# Altium project Holtek_Discovery_BS6xfxxx.PrjPcb
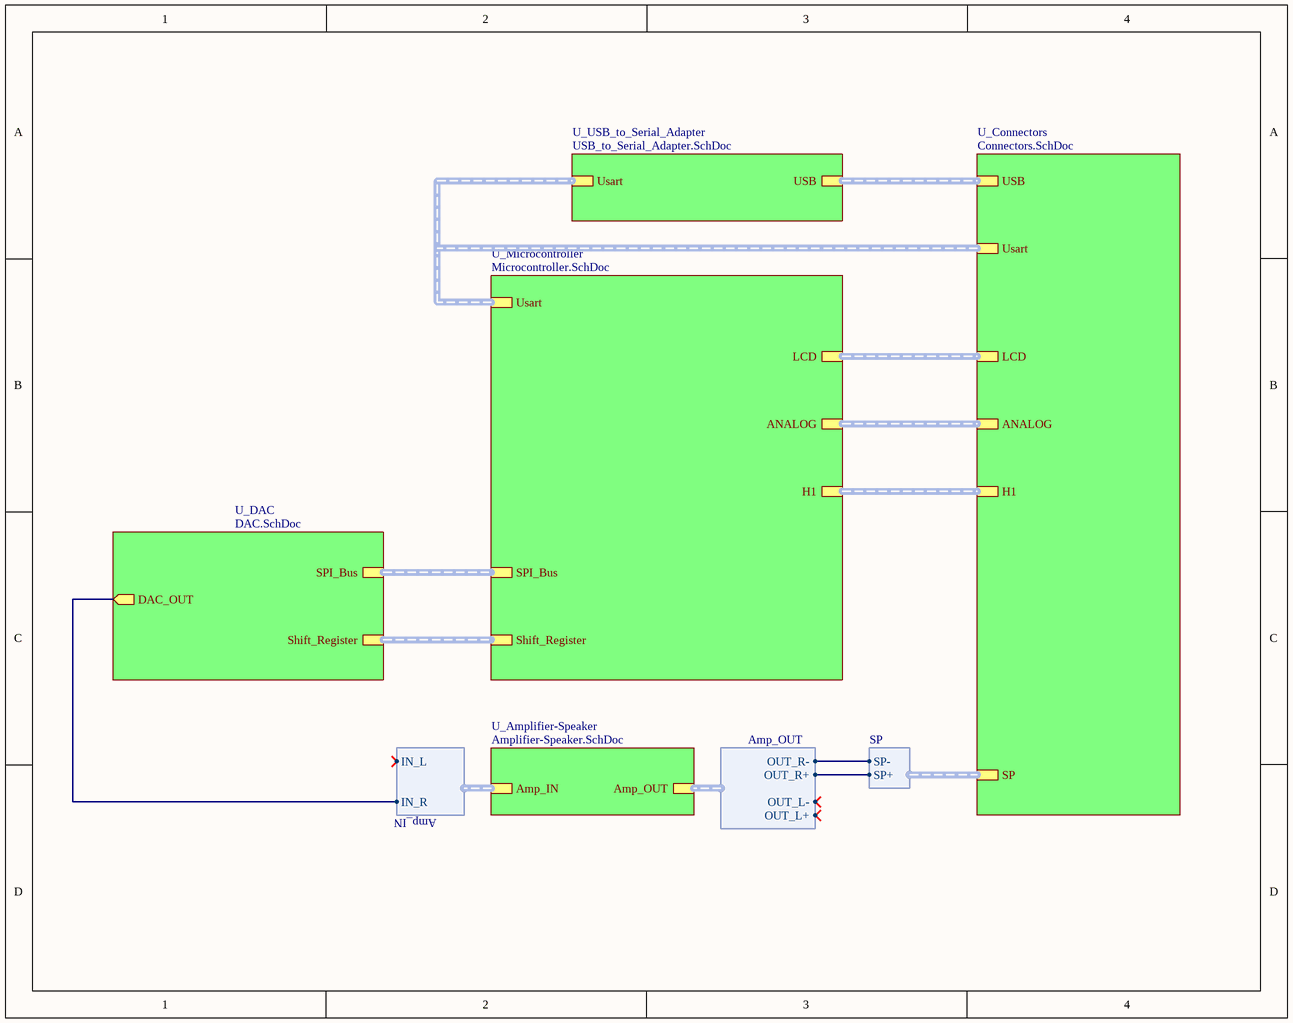
[diagram p0: Multi-sheet.SchDoc]
9 sheets, 72 parts. Net scope: hierarchical (ports join the sheet entries above them; power ports are global).
Board file: Holtek_Discovery_BS6xfxxx_TEST1.PcbDoc
Sheets:
  Multi-sheet.SchDoc
    U_USB_to_Serial_Adapter = USB_to_Serial_Adapter.SchDoc
    U_DAC = DAC.SchDoc
    U_Amplifier-Speaker = Amplifier-Speaker.SchDoc
    U_Microcontroller = Microcontroller.SchDoc
      U_Led-7Segment-Switch = Led-7Segment-Switch.SchDoc
      U_Spi_Flash = Spi_Flash.SchDoc
      U_Capacitive_touch = Capacitive_touch.SchDoc
    U_Connectors = Connectors.SchDoc

## Sheet Multi-sheet.SchDoc
size A; SheetNumber: 1; SheetTotal: 9

### Sub-sheets
U_Amplifier-Speaker = Amplifier-Speaker.SchDoc: Amp_IN (harness Amp_IN), Amp_OUT (harness Amp_OUT)
U_Connectors = Connectors.SchDoc: USB (harness USB), LCD (harness LCD), SP (harness SP), ANALOG (harness ANALOG), H1 (harness H1), Usart (harness Usart)
U_DAC = DAC.SchDoc: SPI_Bus (harness SPI_Bus), DAC_OUT (out), Shift_Register (harness SHIFT_REGISTER)
U_Microcontroller = Microcontroller.SchDoc: SPI_Bus (harness SPI_Bus), Usart (harness Usart), Shift_Register (harness Shift_Register), LCD (harness LCD), H1 (harness h1), ANALOG (harness ANALOG)
U_USB_to_Serial_Adapter = USB_to_Serial_Adapter.SchDoc: USB (harness USB), Usart (harness Usart)

### Harnesses
Amp_IN: IN_L, IN_R
Amp_OUT: OUT_L+, OUT_L-, OUT_R+, OUT_R-
SP: SP+, SP-

### Nets
DAC_OUT: sheet U_DAC/DAC_OUT, sheet U_Amplifier-Speaker/Amp_IN.IN_R
OUT_R+: sheet U_Amplifier-Speaker/Amp_OUT.OUT_R+, sheet U_Connectors/SP.SP+
OUT_R-: sheet U_Amplifier-Speaker/Amp_OUT.OUT_R-, sheet U_Connectors/SP.SP-

### Buses and harness runs
harness sheet U_Connectors/ANALOG = sheet U_Microcontroller/ANALOG
harness sheet U_Connectors/H1 = sheet U_Microcontroller/H1
harness sheet U_Connectors/LCD = sheet U_Microcontroller/LCD
harness sheet U_Connectors/Usart = sheet U_Microcontroller/Usart = sheet U_USB_to_Serial_Adapter/Usart
harness sheet U_Connectors/USB = sheet U_USB_to_Serial_Adapter/USB
harness sheet U_DAC/Shift_Register = sheet U_Microcontroller/Shift_Register
harness sheet U_DAC/SPI_Bus = sheet U_Microcontroller/SPI_Bus

## Sheet USB_to_Serial_Adapter.SchDoc
size 203 x 139 mm; SheetNumber: 8; SheetTotal: 8
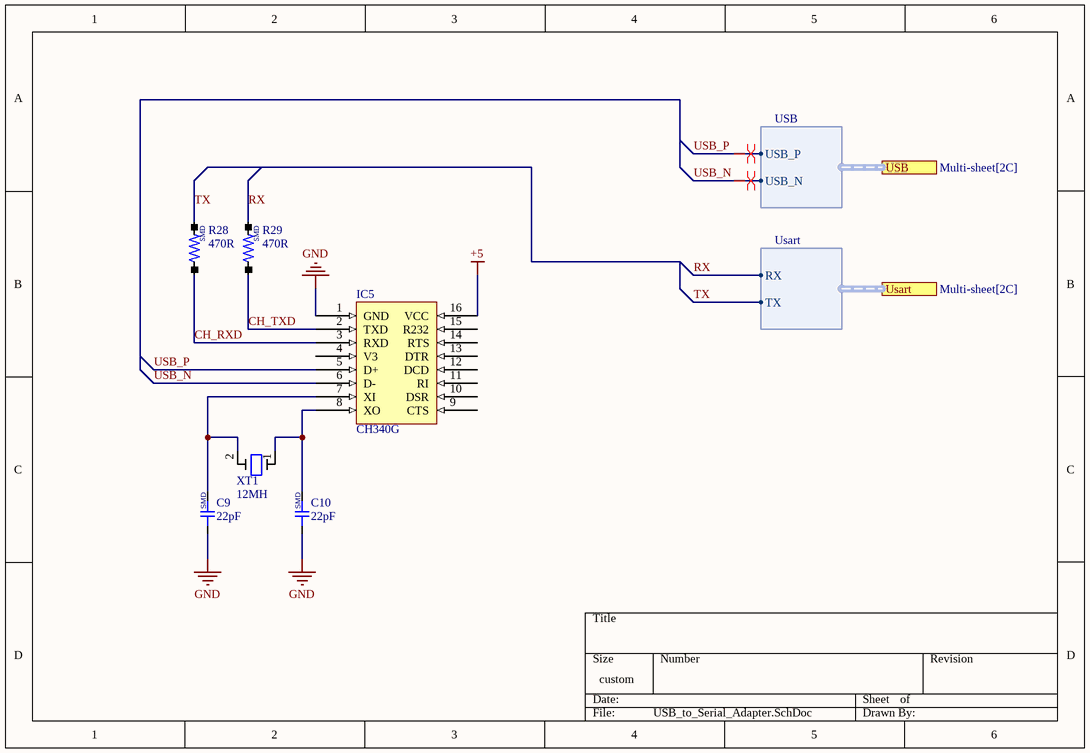
[diagram p1: USB_to_Serial_Adapter.SchDoc]

### Parts
C9  22pF  [CAP-0603]
C10  22pF  [CAP-0603]
IC5  CH340G  [SOP16]
R28  470R  [RES/0603]
R29  470R  [RES/0603]
XT1  12MH  [XTL16MH]

### Ports
Usart (harness Usart, see Multi-sheet[2C]), USB (harness USB, see Multi-sheet[2C])

### Harnesses
USB: USB_P, USB_N
Usart: RX, TX

### Nets
+5: IC5.16(VCC)
GND: C9.1 C10.1 IC5.1(GND)
CH_RXD: IC5.3(RXD) R28.1
CH_TXD: IC5.2(TXD) R29.1
RX: R29.2 ; port Usart.RX
TX: R28.2 ; port Usart.TX
USB_N: IC5.6(D-) ; port USB.USB_N
USB_P: IC5.5(D+) ; port USB.USB_P
NetC9_2: C9.2 IC5.7(XI) XT1.2
NetC10_2: C10.2 IC5.8(XO) XT1.1

Not connected (* = marked no-connect by the designer): IC5 4(V3) 9(CTS) 10(DSR) 11(RI) 12(DCD) 13(DTR) 14(RTS) 15(R232)

### Layout directives
differential pair: USB_N, USB_P

### Notes on the sheet
- (in symbol cap_smd) SMD
- (in symbol RES/SMD) SMD

### Library data of the parts
C9 C10 = cap_smd
R28 R29 = RES/SMD
XT1 = XTL16

## Sheet DAC.SchDoc
size 254 x 241 mm; SheetNumber: 8; SheetTotal: 9
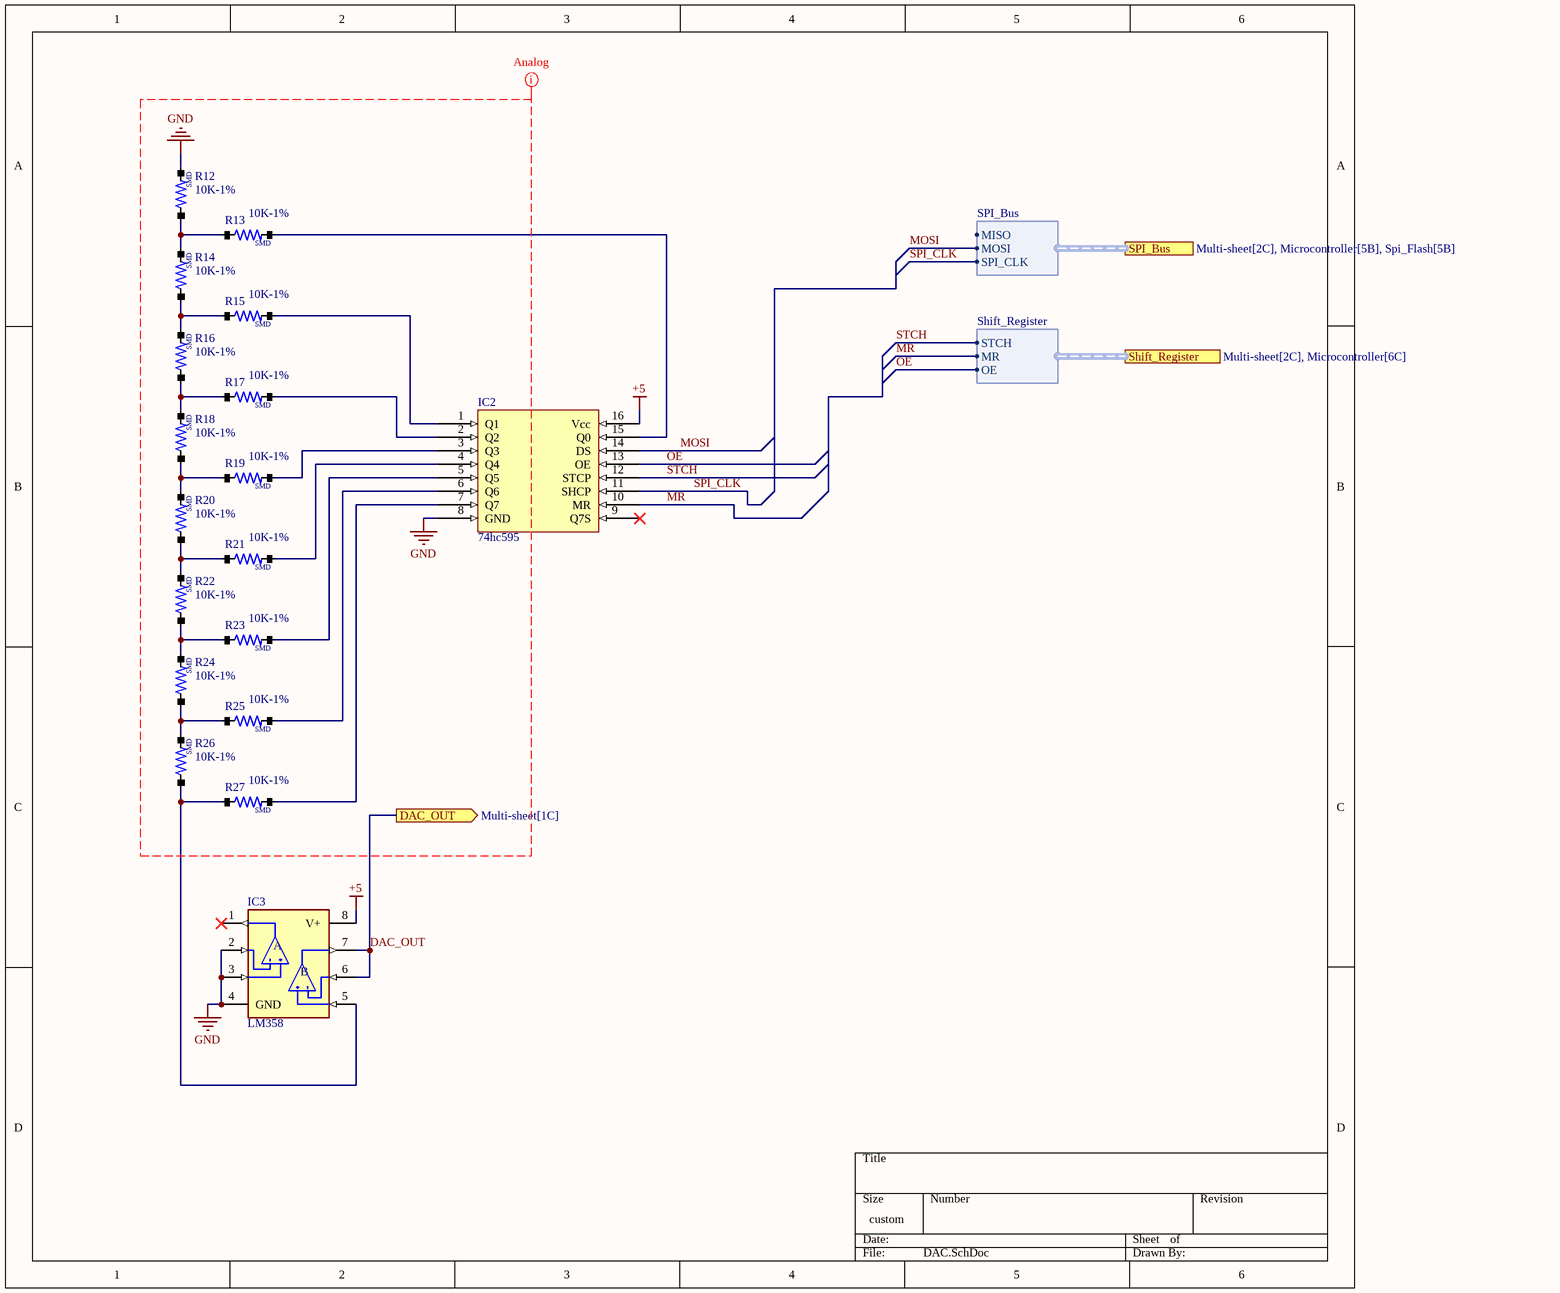
[diagram p2: DAC.SchDoc]

### Parts
IC2  74hc595  [SOP16]
IC3  LM358  [SOP-8]
R12  10K-1%  [RES/0603]
R13  10K-1%  [RES/0603]
R14  10K-1%  [RES/0603]
R15  10K-1%  [RES/0603]
R16  10K-1%  [RES/0603]
R17  10K-1%  [RES/0603]
R18  10K-1%  [RES/0603]
R19  10K-1%  [RES/0603]
R20  10K-1%  [RES/0603]
R21  10K-1%  [RES/0603]
R22  10K-1%  [RES/0603]
R23  10K-1%  [RES/0603]
R24  10K-1%  [RES/0603]
R25  10K-1%  [RES/0603]
R26  10K-1%  [RES/0603]
R27  10K-1%  [RES/0603]

### Ports
DAC_OUT (out, see Multi-sheet[1C]), Shift_Register (harness Shift_Register, see Multi-sheet[2C], Microcontroller[6C]), SPI_Bus (harness SPI_Bus, see Multi-sheet[2C], Microcontroller[5B], Spi_Flash[5B])

### Harnesses
SPI_Bus: MISO, MOSI, SPI_CLK
Shift_Register: STCH, MR, OE

### Nets
+5: IC2.16(Vcc) IC3.8(V+)
GND: IC2.8(GND) IC3.2(-INA) IC3.3(+INA) IC3.4(GND) R12.2
DAC_OUT: IC3.6(-INB) IC3.7(OUTB) ; port DAC_OUT
MOSI: IC2.14(DS) ; port SPI_Bus.MOSI
MR: IC2.10(MR) ; port Shift_Register.MR
OE: IC2.13(OE) ; port Shift_Register.OE
SPI_CLK: IC2.11(SHCP) ; port SPI_Bus.SPI_CLK
STCH: IC2.12(STCP) ; port Shift_Register.STCH
NetIC2_1: IC2.1(Q1) R15.2
NetIC2_2: IC2.2(Q2) R17.2
NetIC2_3: IC2.3(Q3) R19.2
NetIC2_4: IC2.4(Q4) R21.2
NetIC2_5: IC2.5(Q5) R23.2
NetIC2_6: IC2.6(Q6) R25.2
NetIC2_7: IC2.7(Q7) R27.2
NetIC2_15: IC2.15(Q0) R13.2
NetIC3_5: IC3.5(+INB) R26.1 R27.1
NetR12_1: R12.1 R13.1 R14.2
NetR14_1: R14.1 R15.1 R16.2
NetR16_1: R16.1 R17.1 R18.2
NetR18_1: R18.1 R19.1 R20.2
NetR20_1: R20.1 R21.1 R22.2
NetR22_1: R22.1 R23.1 R24.2
NetR24_1: R24.1 R25.1 R26.2

Not connected (* = marked no-connect by the designer): IC2 9(Q7S)*; IC3 1(OUTA)*

### Layout directives
net class Analog: GND

### Notes on the sheet
- (in symbol LM358) A; B
- (in symbol RES/SMD) SMD

### Library data of the parts
R12-R27 = RES/SMD

## Sheet Amplifier-Speaker.SchDoc
size A; SheetNumber: 7; SheetTotal: 9
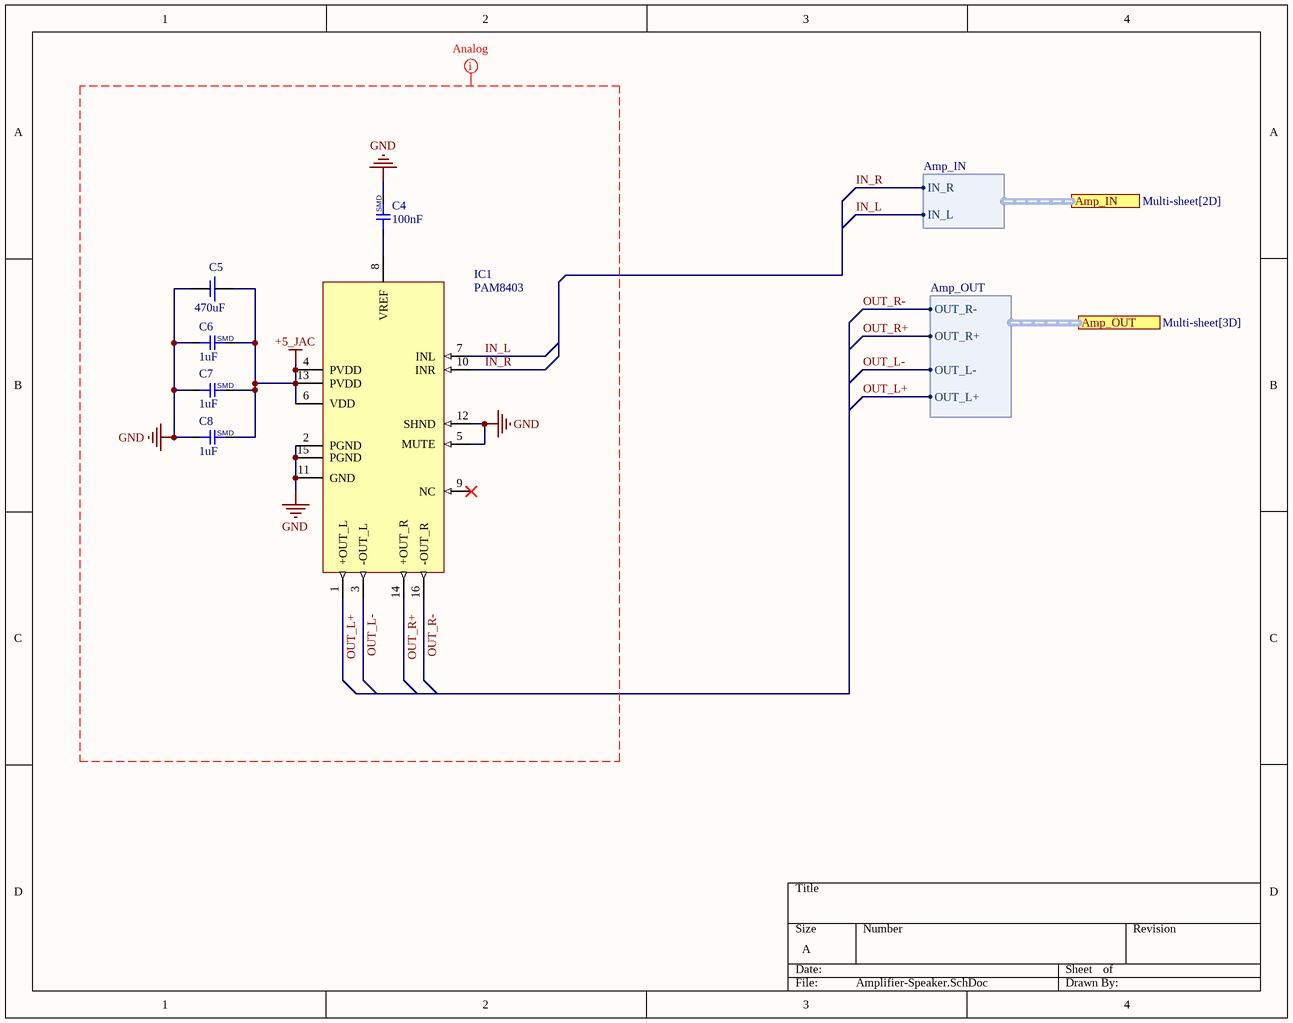
[diagram p3: Amplifier-Speaker.SchDoc]

### Parts
C4  100nF  [CAP-0603]
C5  470uF  [cap/330u/16v]
C6  1uF  [CAP-0805]
C7  1uF  [CAP-0805]
C8  1uF  [CAP-0805]
IC1  PAM8403  [SOP16]

### Ports
Amp_IN (harness Amp_IN, see Multi-sheet[2D]), Amp_OUT (harness Amp_OUT, see Multi-sheet[3D])

### Harnesses
Amp_IN: IN_R, IN_L
Amp_OUT: OUT_R-, OUT_R+, OUT_L-, OUT_L+

### Nets
+5_JAC: C5.+ C6.2 C7.2 C8.2 IC1.4(PVDD) IC1.6(VDD) IC1.13(PVDD)
GND: C4.2 C5.- C6.1 C7.1 C8.1 IC1.2(PGND) IC1.5(MUTE) IC1.11(GND) IC1.12(SHND) IC1.15(PGND)
IN_L: IC1.7(INL) ; port Amp_IN.IN_L
IN_R: IC1.10(INR) ; port Amp_IN.IN_R  [project net DAC_OUT]
OUT_L+: IC1.1(+OUT_L) ; port Amp_OUT.OUT_L+
OUT_L-: IC1.3(-OUT_L) ; port Amp_OUT.OUT_L-
OUT_R+: IC1.14(+OUT_R) ; port Amp_OUT.OUT_R+
OUT_R-: IC1.16(-OUT_R) ; port Amp_OUT.OUT_R-
NetC4_1: C4.1 IC1.8(VREF)

Not connected (* = marked no-connect by the designer): IC1 9(NC)*

### Layout directives
net class Analog: +5_JAC, GND, IN_L, IN_R, OUT_L+, OUT_L-, OUT_R+, OUT_R-

### Notes on the sheet
- (in symbol cap_smd) SMD

### Library data of the parts
C4 C6-C8 = cap_smd
C5 = cap-electrolit
IC1 = PAM8403: STEREO AUDIO AMPLIFIER

## Sheet Microcontroller.SchDoc
size 381 x 241 mm; SheetNumber: 3; SheetTotal: 9
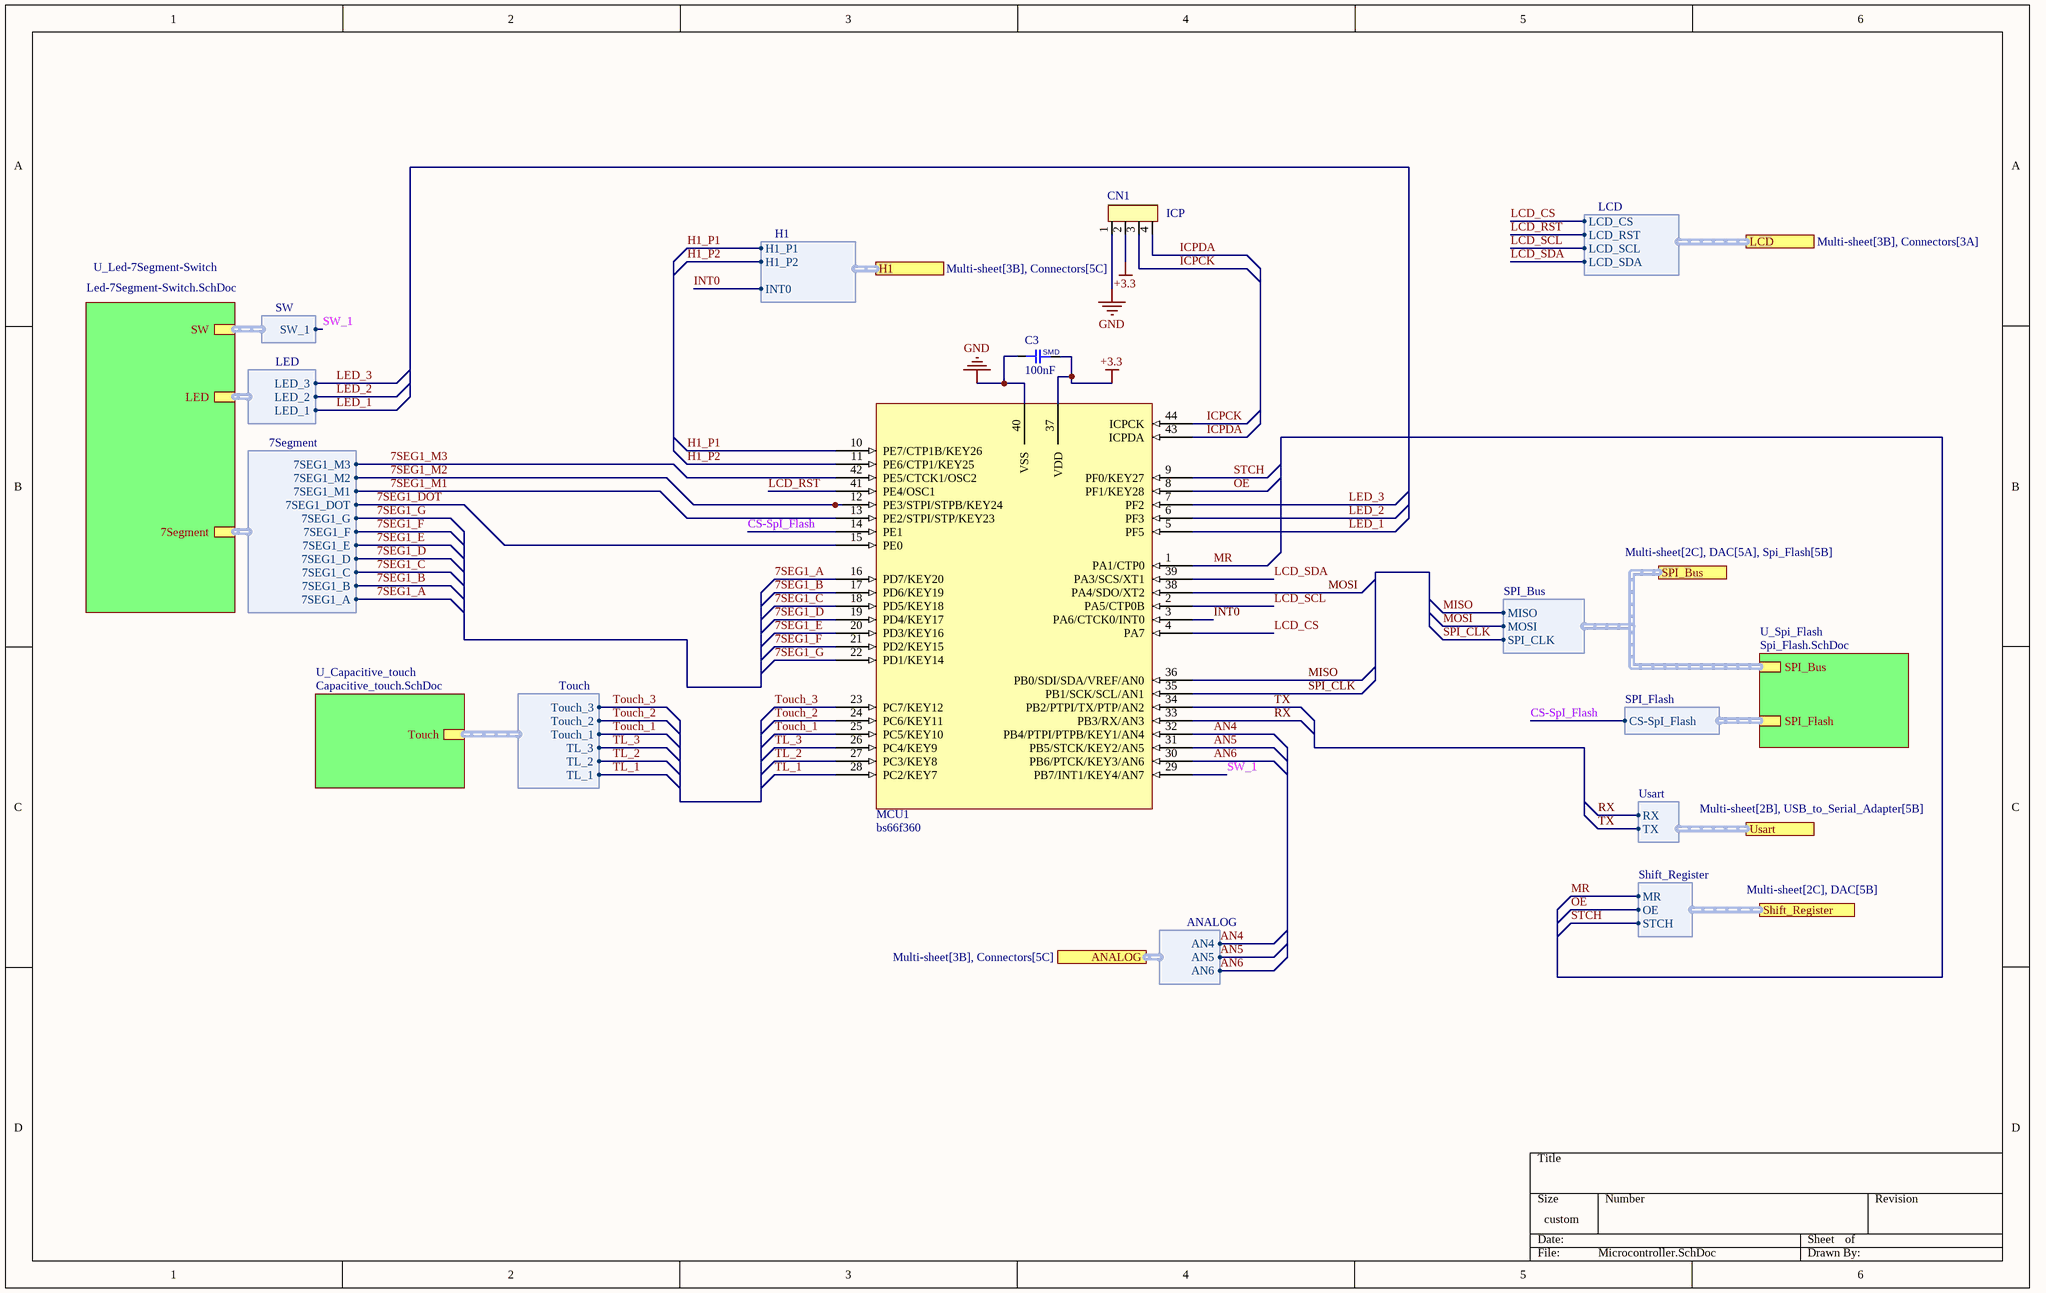
[diagram p4: Microcontroller.SchDoc]

### Parts
C3  100nF  [CAP-0603]
CN1  ICP  [CONECTOR/XH/4PIN]
MCU1  bs66f360  [bs66f360]

### Sub-sheets
U_Capacitive_touch = Capacitive_touch.SchDoc: Touch (harness Touch)
U_Led-7Segment-Switch = Led-7Segment-Switch.SchDoc: LED (harness LED), 7Segment (harness 7Segment), SW (harness SW)
U_Spi_Flash = Spi_Flash.SchDoc: SPI_Flash (harness SPI_Flash), SPI_Bus (harness SPI_Bus)

### Ports
ANALOG (harness ANALOG, see Multi-sheet[3B], Connectors[5C]), H1 (harness H1, see Multi-sheet[3B], Connectors[5C]), LCD (harness LCD, see Multi-sheet[3B], Connectors[3A]), Shift_Register (harness Shift_Register, see Multi-sheet[2C], DAC[5B]), SPI_Bus (harness SPI_Bus, see Multi-sheet[2C], DAC[5A], Spi_Flash[5B]), Usart (harness Usart, see Multi-sheet[2B], USB_to_Serial_Adapter[5B])

### Harnesses
7Segment: 7SEG1_A, 7SEG1_B, 7SEG1_C, 7SEG1_D, 7SEG1_DOT, 7SEG1_E, 7SEG1_F, 7SEG1_G, 7SEG1_M1, 7SEG1_M2, 7SEG1_M3
LED: LED_1, LED_2, LED_3
SW: SW_1
SPI_Bus: MISO, MOSI, SPI_CLK
SPI_Flash: CS-SpI_Flash
Usart: RX, TX
Shift_Register: MR, OE, STCH
Touch: TL_1, TL_2, TL_3, Touch_1, Touch_2, Touch_3
LCD: LCD_CS, LCD_RST, LCD_SCL, LCD_SDA
H1: H1_P1, H1_P2, INT0
ANALOG: AN4, AN5, AN6

### Nets
+3.3: C3.2 CN1.2 MCU1.37(VDD)
GND: C3.1 CN1.1 MCU1.40(VSS)
7SEG1_A: MCU1.16(PD7/KEY20) ; sheet U_Led-7Segment-Switch/7Segment.7SEG1_A
7SEG1_B: MCU1.17(PD6/KEY19) ; sheet U_Led-7Segment-Switch/7Segment.7SEG1_B
7SEG1_C: MCU1.18(PD5/KEY18) ; sheet U_Led-7Segment-Switch/7Segment.7SEG1_C
7SEG1_D: MCU1.19(PD4/KEY17) ; sheet U_Led-7Segment-Switch/7Segment.7SEG1_D
7SEG1_DOT: MCU1.15(PE0) ; sheet U_Led-7Segment-Switch/7Segment.7SEG1_DOT
7SEG1_E: MCU1.20(PD3/KEY16) ; sheet U_Led-7Segment-Switch/7Segment.7SEG1_E
7SEG1_F: MCU1.21(PD2/KEY15) ; sheet U_Led-7Segment-Switch/7Segment.7SEG1_F
7SEG1_G: MCU1.22(PD1/KEY14) ; sheet U_Led-7Segment-Switch/7Segment.7SEG1_G
7SEG1_M1: MCU1.13(PE2/STPI/STP/KEY23) ; sheet U_Led-7Segment-Switch/7Segment.7SEG1_M1
7SEG1_M2: MCU1.12(PE3/STPI/STPB/KEY24) ; sheet U_Led-7Segment-Switch/7Segment.7SEG1_M2
7SEG1_M3: MCU1.42(PE5/CTCK1/OSC2) ; sheet U_Led-7Segment-Switch/7Segment.7SEG1_M3
AN4: MCU1.32(PB4/PTPI/PTPB/KEY1/AN4) ; port ANALOG.AN4
AN5: MCU1.31(PB5/STCK/KEY2/AN5) ; port ANALOG.AN5
AN6: MCU1.30(PB6/PTCK/KEY3/AN6) ; port ANALOG.AN6
CS-SpI_Flash: MCU1.14(PE1) ; sheet U_Spi_Flash/SPI_Flash.CS-SpI_Flash
H1_P1: MCU1.10(PE7/CTP1B/KEY26) ; port H1.H1_P1
H1_P2: MCU1.11(PE6/CTP1/KEY25) ; port H1.H1_P2
ICPCK: CN1.3 MCU1.44(ICPCK)
ICPDA: CN1.4 MCU1.43(ICPDA)
INT0: MCU1.3(PA6/CTCK0/INT0) ; port H1.INT0
LCD_CS: MCU1.4(PA7) ; port LCD.LCD_CS
LCD_RST: MCU1.41(PE4/OSC1) ; port LCD.LCD_RST
LCD_SCL: MCU1.2(PA5/CTP0B) ; port LCD.LCD_SCL
LCD_SDA: MCU1.39(PA3/SCS/XT1) ; port LCD.LCD_SDA
LED_1: MCU1.5(PF5) ; sheet U_Led-7Segment-Switch/LED.LED_1
LED_2: MCU1.6(PF3) ; sheet U_Led-7Segment-Switch/LED.LED_2
LED_3: MCU1.7(PF2) ; sheet U_Led-7Segment-Switch/LED.LED_3
MISO: MCU1.36(PB0/SDI/SDA/VREF/AN0) ; port SPI_Bus.MISO
MOSI: MCU1.38(PA4/SDO/XT2) ; port SPI_Bus.MOSI
MR: MCU1.1(PA1/CTP0) ; port Shift_Register.MR
OE: MCU1.8(PF1/KEY28) ; port Shift_Register.OE
RX: MCU1.33(PB3/RX/AN3) ; port Usart.RX
SPI_CLK: MCU1.35(PB1/SCK/SCL/AN1) ; port SPI_Bus.SPI_CLK
STCH: MCU1.9(PF0/KEY27) ; port Shift_Register.STCH
SW_1: MCU1.29(PB7/INT1/KEY4/AN7) ; sheet U_Led-7Segment-Switch/SW.SW_1
TL_1: MCU1.28(PC2/KEY7) ; sheet U_Capacitive_touch/Touch.TL_1
TL_2: MCU1.27(PC3/KEY8) ; sheet U_Capacitive_touch/Touch.TL_2
TL_3: MCU1.26(PC4/KEY9) ; sheet U_Capacitive_touch/Touch.TL_3
Touch_1: MCU1.25(PC5/KEY10) ; sheet U_Capacitive_touch/Touch.Touch_1
Touch_2: MCU1.24(PC6/KEY11) ; sheet U_Capacitive_touch/Touch.Touch_2
Touch_3: MCU1.23(PC7/KEY12) ; sheet U_Capacitive_touch/Touch.Touch_3
TX: MCU1.34(PB2/PTPI/TX/PTP/AN2) ; port Usart.TX

### Buses and harness runs
harness port SPI_Bus = sheet U_Spi_Flash/SPI_Bus

### Notes on the sheet
- (in symbol cap_smd) SMD

### Library data of the parts
C3 = cap_smd
CN1 = CONECTOR/XH/4PIN

## Sheet Led-7Segment-Switch.SchDoc
size 254 x 241 mm; SheetNumber: 3; SheetTotal: 8
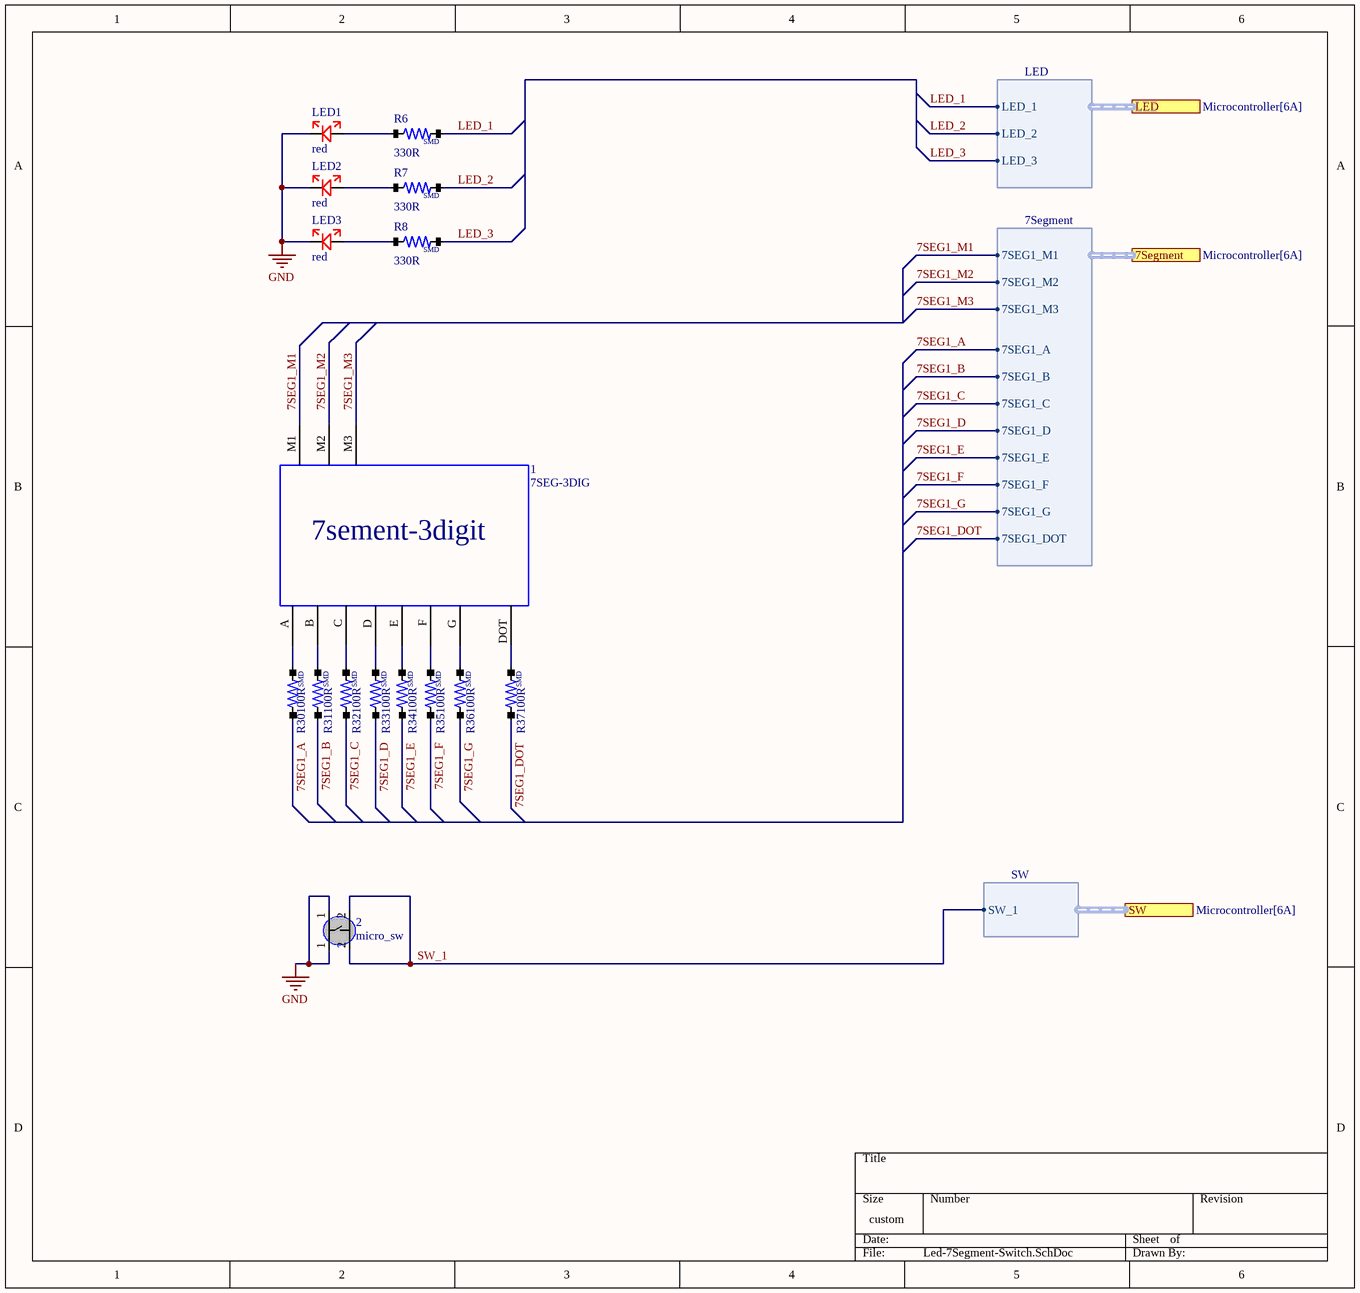
[diagram p5: Led-7Segment-Switch.SchDoc]

### Parts
1  7SEG-3DIG  [7seg-3d]
2  micro_sw  [micro_switch_smd]
LED1  red  [LED/0805]
LED2  red  [LED/0805]
LED3  red  [LED/0805]
R6  330R  [RES/0603]
R7  330R  [RES/0603]
R8  330R  [RES/0603]
R30  100R  [RES/0603]
R31  100R  [RES/0603]
R32  100R  [RES/0603]
R33  100R  [RES/0603]
R34  100R  [RES/0603]
R35  100R  [RES/0603]
R36  100R  [RES/0603]
R37  100R  [RES/0603]

### Ports
7Segment (harness 7Segment, see Microcontroller[6A]), LED (harness LED, see Microcontroller[6A]), SW (harness SW, see Microcontroller[6A])

### Harnesses
LED: LED_1, LED_2, LED_3
7Segment: 7SEG1_M1, 7SEG1_M2, 7SEG1_M3, 7SEG1_A, 7SEG1_B, 7SEG1_C, 7SEG1_D, 7SEG1_E, 7SEG1_F, 7SEG1_G, 7SEG1_DOT
SW: SW_1

### Nets
GND: 2.1 LED1.A LED2.A LED3.A
7SEG1_A: R30.1 ; port 7Segment.7SEG1_A
7SEG1_B: R31.1 ; port 7Segment.7SEG1_B
7SEG1_C: R32.1 ; port 7Segment.7SEG1_C
7SEG1_D: R33.1 ; port 7Segment.7SEG1_D
7SEG1_DOT: R37.1 ; port 7Segment.7SEG1_DOT
7SEG1_E: R34.1 ; port 7Segment.7SEG1_E
7SEG1_F: R35.1 ; port 7Segment.7SEG1_F
7SEG1_G: R36.1 ; port 7Segment.7SEG1_G
7SEG1_M1: 1.M1 ; port 7Segment.7SEG1_M1
7SEG1_M2: 1.M2 ; port 7Segment.7SEG1_M2
7SEG1_M3: 1.M3 ; port 7Segment.7SEG1_M3
LED_1: R6.2 ; port LED.LED_1
LED_2: R7.2 ; port LED.LED_2
LED_3: R8.2 ; port LED.LED_3
SW_1: 2.2 ; port SW.SW_1
Net1_A: 1.A R30.2
Net1_B: 1.B R31.2
Net1_C: 1.C R32.2
Net1_D: 1.D R33.2
Net1_DOT: 1.DOT R37.2
Net1_E: 1.E R34.2
Net1_F: 1.F R35.2
Net1_G: 1.G R36.2
NetLED1_K: LED1.K R6.1
NetLED2_K: LED2.K R7.1
NetLED3_K: LED3.K R8.1

### Notes on the sheet
- (in symbol 7SEG-3DIG) 7sement-3digit
- (in symbol RES/SMD) SMD

### Library data of the parts
LED1-LED3 = LED-1COLER
R6-R8 R30-R37 = RES/SMD

## Sheet Spi_Flash.SchDoc
size 127 x 127 mm; SheetNumber: 6; SheetTotal: 8
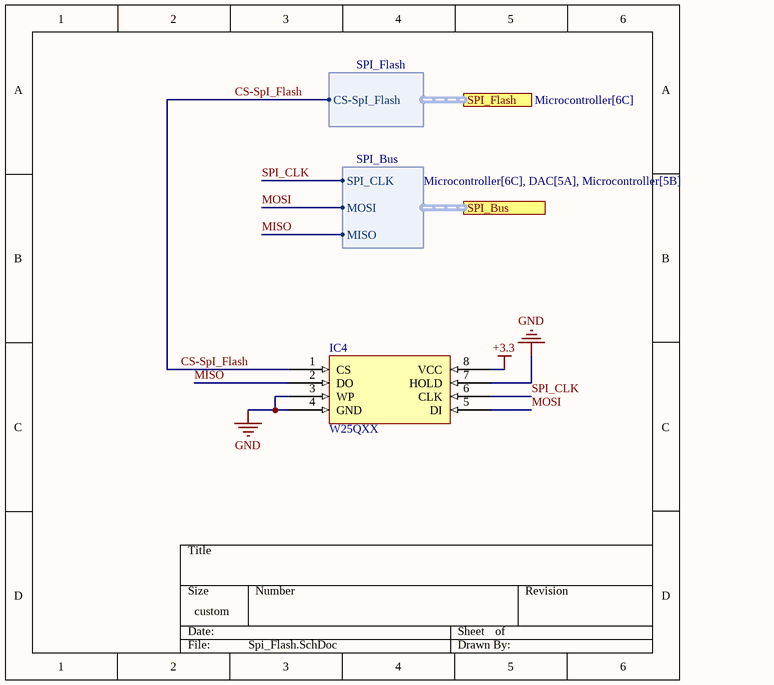
[diagram p6: Spi_Flash.SchDoc]

### Parts
IC4  W25QXX  [SOIC-8PIN-280MIL]

### Ports
SPI_Bus (harness SPI_Bus, see Microcontroller[6C], DAC[5A], Microcontroller[5B]), SPI_Flash (harness SPI_Flash, see Microcontroller[6C])

### Harnesses
SPI_Flash: CS-SpI_Flash
SPI_Bus: SPI_CLK, MOSI, MISO

### Nets
+3.3: IC4.8(VCC)
GND: IC4.3(WP) IC4.4(GND) IC4.7(HOLD)
CS-SpI_Flash: IC4.1(CS) ; port SPI_Flash.CS-SpI_Flash
MISO: IC4.2(DO) ; port SPI_Bus.MISO
MOSI: IC4.5(DI) ; port SPI_Bus.MOSI
SPI_CLK: IC4.6(CLK) ; port SPI_Bus.SPI_CLK

## Sheet Capacitive_touch.SchDoc
size 228 x 139 mm; SheetNumber: 4; SheetTotal: 8
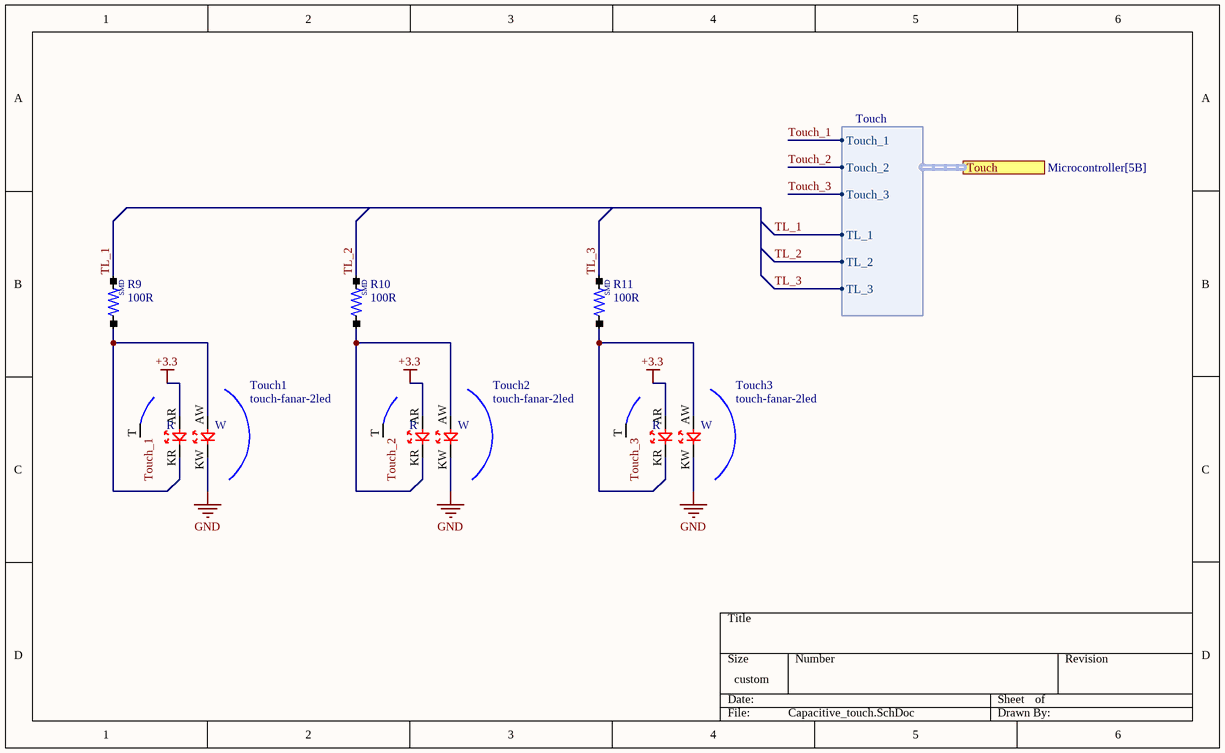
[diagram p7: Capacitive_touch.SchDoc]

### Parts
R9  100R  [RES/0603]
R10  100R  [RES/0603]
R11  100R  [RES/0603]
Touch1  touch-fanar-2led  [fanar-touch-2led]
Touch2  touch-fanar-2led  [fanar-touch-2led]
Touch3  touch-fanar-2led  [fanar-touch-2led]

### Ports
Touch (harness Touch, see Microcontroller[5B])

### Harnesses
Touch: Touch_1, Touch_2, Touch_3, TL_1, TL_2, TL_3

### Nets
+3.3: Touch1.AR Touch2.AR Touch3.AR
GND: Touch1.KW Touch2.KW Touch3.KW
TL_1: R9.2 ; port Touch.TL_1
TL_2: R10.2 ; port Touch.TL_2
TL_3: R11.2 ; port Touch.TL_3
Touch_1: Touch1.T ; port Touch.Touch_1
Touch_2: Touch2.T ; port Touch.Touch_2
Touch_3: Touch3.T ; port Touch.Touch_3
NetR9_1: R9.1 Touch1.AW Touch1.KR
NetR10_1: R10.1 Touch2.AW Touch2.KR
NetR11_1: R11.1 Touch3.AW Touch3.KR

### Notes on the sheet
- (in symbol RES/SMD) SMD
- (in symbol touch-fanar-2led) R; W

### Library data of the parts
R9-R11 = RES/SMD

## Sheet Connectors.SchDoc
size 279 x 241 mm; SheetNumber: 2; SheetTotal: 9
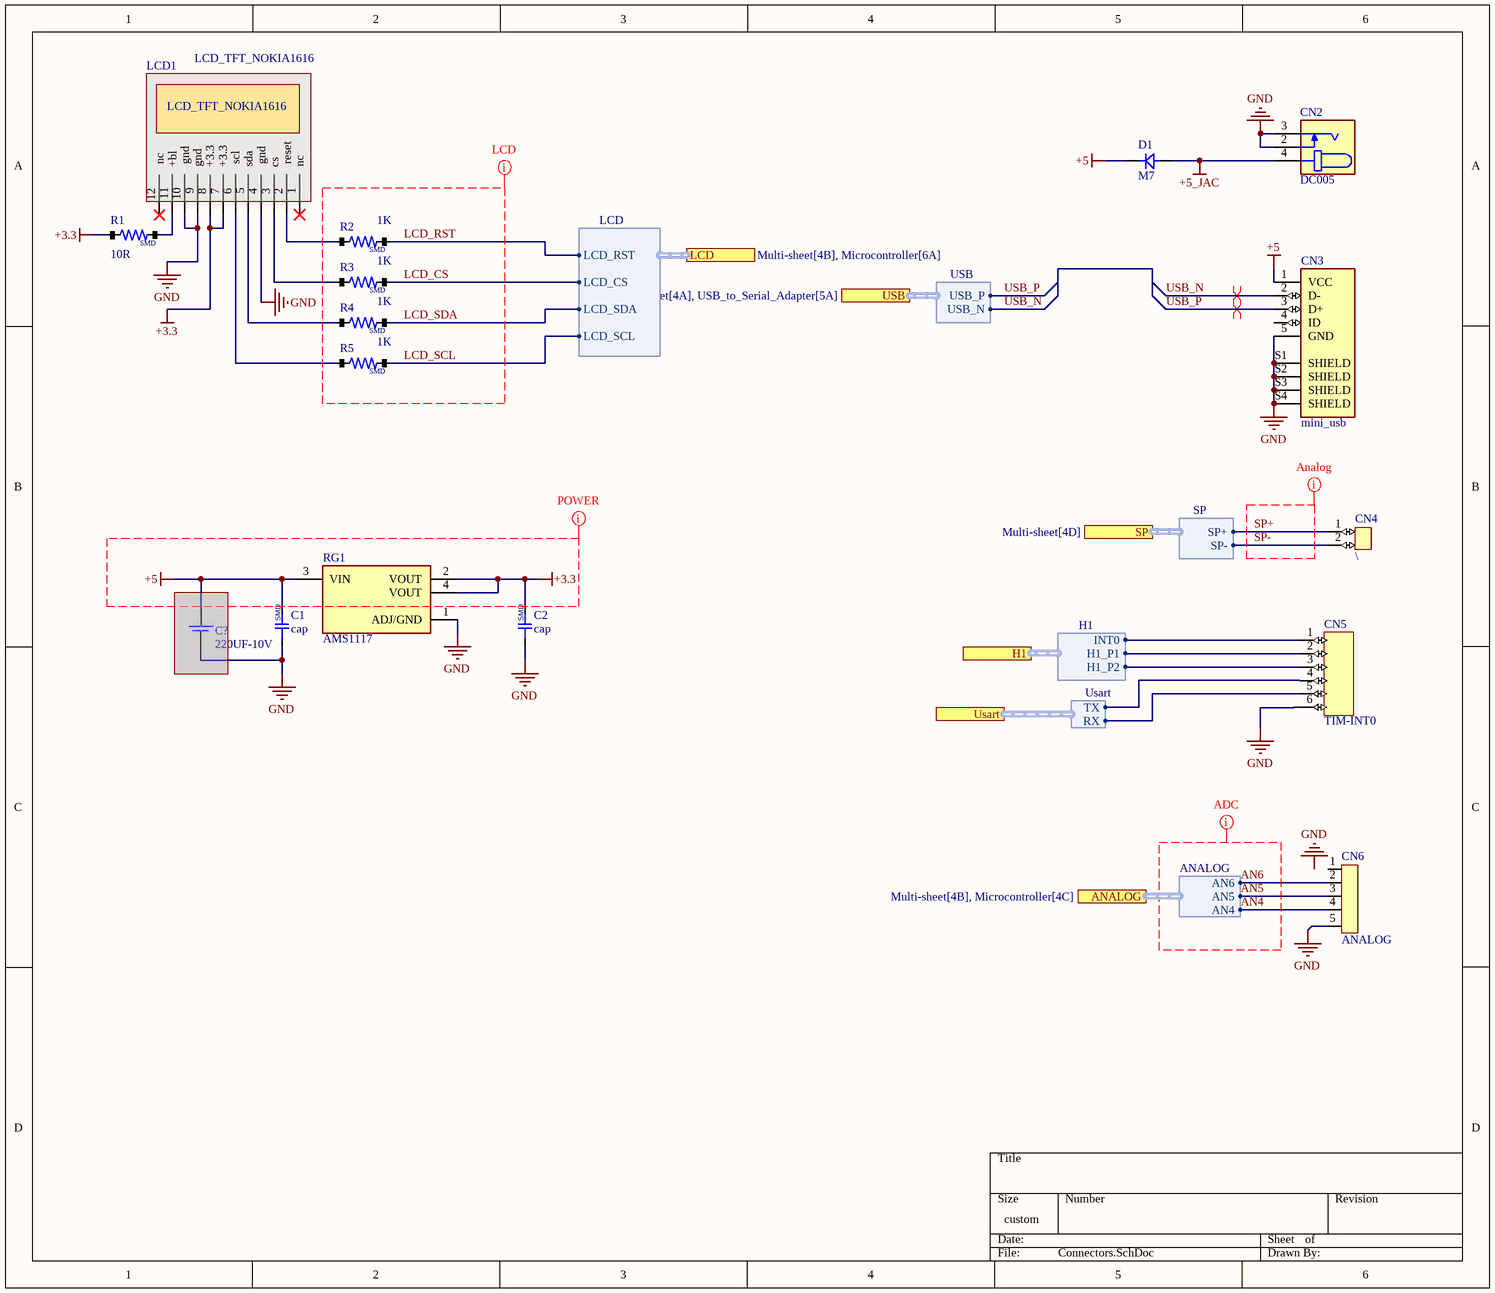
[diagram p8: Connectors.SchDoc]

### Parts
C1  cap  [CAP-0603]
C2  cap  [CAP-0603]
C?  220UF-10V  [cap/330u/16v]  (masked out: inside a compile mask, not in the netlist)
CN2  DC005  [dc005]
CN3  mini_usb  [usb_mini_smd]
CN4  \  [CONECTOR/XH/2PIN]
CN5  TIM-INT0  [pin_header_6pin]
CN6  ANALOG  [XH5]
D1  M7  [DIOD/1N4007/SMD]
LCD1  LCD_TFT_NOKIA1616  [lcd1616-flat]
R1  10R  [RES/0805]
R2  1K  [RES/0805]
R3  1K  [RES/0805]
R4  1K  [RES/0805]
R5  1K  [RES/0805]
RG1  AMS1117  [AMS1117]

### Ports
ANALOG (harness ANALOG, see Multi-sheet[4B], Microcontroller[4C]), H1 (harness H1), LCD (harness LCD, see Multi-sheet[4B], Microcontroller[6A]), SP (harness SP, see Multi-sheet[4D]), Usart (harness Usart), USB (harness USB, see Multi-sheet[4A], USB_to_Serial_Adapter[5A])

### Harnesses
USB: USB_N, USB_P
LCD: LCD_RST, LCD_CS, LCD_SDA, LCD_SCL
SP: SP-, SP+
ANALOG: AN4, AN5, AN6
H1: H1_P1, H1_P2, INT0
Usart: RX, TX

### Nets
+3.3: C2.2 LCD1.7(+3.3) LCD1.8(+3.3) R1.1 RG1.2(VOUT) RG1.4(VOUT)
+5: C1.2 CN3.1(VCC) D1.K RG1.3(VIN)
+5_JAC: CN2.4 D1.A
GND: C1.1 C2.1 CN2.2 CN2.3 CN3.5(GND) CN3.S1(SHIELD) CN3.S2(SHIELD) CN3.S3(SHIELD) CN3.S4(SHIELD) CN5.6 CN6.5 LCD1.4(gnd) LCD1.9(gnd) LCD1.10(gnd) RG1.1(ADJ/GND)
AN4: CN6.4 ; port ANALOG.AN4
AN5: CN6.3 ; port ANALOG.AN5
AN6: CN6.2 ; port ANALOG.AN6
H1_P1: CN5.2 ; port H1.H1_P1
H1_P2: CN5.3 ; port H1.H1_P2
INT0: CN5.1 ; port H1.INT0
LCD_CS: R3.2 ; port LCD.LCD_CS
LCD_RST: R2.2 ; port LCD.LCD_RST
LCD_SCL: R5.2 ; port LCD.LCD_SCL
LCD_SDA: R4.2 ; port LCD.LCD_SDA
RX: CN5.5 ; port Usart.RX
SP+: CN4.1 ; port SP.SP+  [project net OUT_R+]
SP-: CN4.2 ; port SP.SP-  [project net OUT_R-]
TX: CN5.4 ; port Usart.TX
USB_N: CN3.2(D-) ; port USB.USB_N
USB_P: CN3.3(D+) ; port USB.USB_P
NetLCD1_2: LCD1.2(reset) R2.1
NetLCD1_3: LCD1.3(cs) R3.1
NetLCD1_5: LCD1.5(sda) R4.1
NetLCD1_6: LCD1.6(scl) R5.1
NetLCD1_11: LCD1.11(+bl) R1.2

Not connected (* = marked no-connect by the designer): CN3 4(ID); CN6 1; LCD1 1(nc)* 12(_nc)*

### Layout directives
differential pair: USB_N, USB_P
net class POWER: +3.3, +5
net class LCD: LCD_CS, LCD_RST, LCD_SCL, LCD_SDA
net class Analog: SP+, SP-
net class ADC: AN4, AN5, AN6

### Notes on the sheet
- Labels drawn without touching a wire or pin: GND
- (in symbol cap_smd) SMD
- (in symbol RES/SMD) SMD

### Library data of the parts
C1 C2 = cap_smd
C? = cap-electrolit
CN2 = JAC_ADAPTOR
CN3 = usb_mini
CN4 = CONECTOR/XH/2PIN
CN5 = PIN_HEADER6
CN6 = XH5
D1 = DIOD/RECTIFIERS
LCD1 = lcd_nokia1616
R1-R5 = RES/SMD

## Nets that join several sheets
+3.3: Microcontroller (C3.2 CN1.2 MCU1.37), Spi_Flash (IC4.8), Capacitive_touch (Touch1.AR Touch2.AR Touch3.AR), Connectors (6 pins)
+5: USB_to_Serial_Adapter (IC5.16), DAC (IC2.16 IC3.8), Connectors (C1.2 CN3.1 D1.K RG1.3)
+5_JAC: Amplifier-Speaker (7 pins), Connectors (CN2.4 D1.A)
GND: USB_to_Serial_Adapter (C9.1 C10.1 IC5.1), DAC (5 pins), Amplifier-Speaker (10 pins), Microcontroller (C3.1 CN1.1 MCU1.40), Led-7Segment-Switch (2.1 LED1.A LED2.A LED3.A), Spi_Flash (IC4.3 IC4.4 IC4.7), Capacitive_touch (Touch1.KW Touch2.KW Touch3.KW), Connectors (15 pins)
7SEG1_A: Microcontroller (MCU1.16), Led-7Segment-Switch (R30.1)
7SEG1_B: Microcontroller (MCU1.17), Led-7Segment-Switch (R31.1)
7SEG1_C: Microcontroller (MCU1.18), Led-7Segment-Switch (R32.1)
7SEG1_D: Microcontroller (MCU1.19), Led-7Segment-Switch (R33.1)
7SEG1_DOT: Microcontroller (MCU1.15), Led-7Segment-Switch (R37.1)
7SEG1_E: Microcontroller (MCU1.20), Led-7Segment-Switch (R34.1)
7SEG1_F: Microcontroller (MCU1.21), Led-7Segment-Switch (R35.1)
7SEG1_G: Microcontroller (MCU1.22), Led-7Segment-Switch (R36.1)
7SEG1_M1: Microcontroller (MCU1.13), Led-7Segment-Switch (1.M1)
7SEG1_M2: Microcontroller (MCU1.12), Led-7Segment-Switch (1.M2)
7SEG1_M3: Microcontroller (MCU1.42), Led-7Segment-Switch (1.M3)
AN4: Microcontroller (MCU1.32), Connectors (CN6.4)
AN5: Microcontroller (MCU1.31), Connectors (CN6.3)
AN6: Microcontroller (MCU1.30), Connectors (CN6.2)
CS-SpI_Flash: Microcontroller (MCU1.14), Spi_Flash (IC4.1)
DAC_OUT: DAC (IC3.6 IC3.7), Amplifier-Speaker (IC1.10)
H1_P1: Microcontroller (MCU1.10), Connectors (CN5.2)
H1_P2: Microcontroller (MCU1.11), Connectors (CN5.3)
INT0: Microcontroller (MCU1.3), Connectors (CN5.1)
LCD_CS: Microcontroller (MCU1.4), Connectors (R3.2)
LCD_RST: Microcontroller (MCU1.41), Connectors (R2.2)
LCD_SCL: Microcontroller (MCU1.2), Connectors (R5.2)
LCD_SDA: Microcontroller (MCU1.39), Connectors (R4.2)
LED_1: Microcontroller (MCU1.5), Led-7Segment-Switch (R6.2)
LED_2: Microcontroller (MCU1.6), Led-7Segment-Switch (R7.2)
LED_3: Microcontroller (MCU1.7), Led-7Segment-Switch (R8.2)
MISO: Microcontroller (MCU1.36), Spi_Flash (IC4.2)
MOSI: DAC (IC2.14), Microcontroller (MCU1.38), Spi_Flash (IC4.5)
MR: DAC (IC2.10), Microcontroller (MCU1.1)
OE: DAC (IC2.13), Microcontroller (MCU1.8)
OUT_R+: Amplifier-Speaker (IC1.14), Connectors (CN4.1)
OUT_R-: Amplifier-Speaker (IC1.16), Connectors (CN4.2)
RX: USB_to_Serial_Adapter (R29.2), Microcontroller (MCU1.33), Connectors (CN5.5)
SPI_CLK: DAC (IC2.11), Microcontroller (MCU1.35), Spi_Flash (IC4.6)
STCH: DAC (IC2.12), Microcontroller (MCU1.9)
SW_1: Microcontroller (MCU1.29), Led-7Segment-Switch (2.2)
TL_1: Microcontroller (MCU1.28), Capacitive_touch (R9.2)
TL_2: Microcontroller (MCU1.27), Capacitive_touch (R10.2)
TL_3: Microcontroller (MCU1.26), Capacitive_touch (R11.2)
Touch_1: Microcontroller (MCU1.25), Capacitive_touch (Touch1.T)
Touch_2: Microcontroller (MCU1.24), Capacitive_touch (Touch2.T)
Touch_3: Microcontroller (MCU1.23), Capacitive_touch (Touch3.T)
TX: USB_to_Serial_Adapter (R28.2), Microcontroller (MCU1.34), Connectors (CN5.4)
USB_N: USB_to_Serial_Adapter (IC5.6), Connectors (CN3.2)
USB_P: USB_to_Serial_Adapter (IC5.5), Connectors (CN3.3)